# EAGLE schematic voltage_regulator (EAGLE 8.6.3)
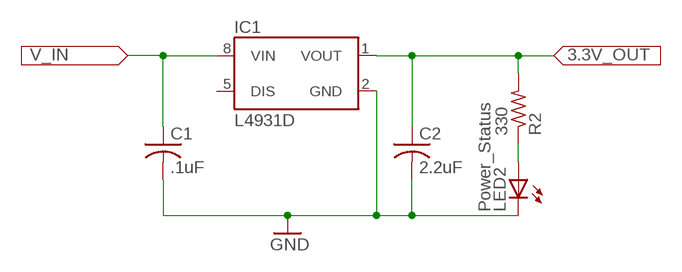
[diagram p0: schematic, sheet 1]

## Parts
C1  .1uF  C-US050-024X044  [C050-024X044]
C2  2.2uF  C-US050-024X044  [C050-024X044]
IC1  L4931D  [SO08]
LED2  Power_Status  NFSG036BT  [NFSG036BT]
R2  330  R-US_R0805  [R0805]

## Nets
3.3V: C2.1 IC1.1(VOUT) R2.2
GND: C1.2 C2.2 IC1.2(GND) LED2.C
N$1: LED2.A R2.1
N$5: C1.1 IC1.8(VIN)
Unconnected: IC1.5(DIS)

## Library data of the parts
C1 C2 = rcl:C-US: CAPACITOR, American symbol; SPICEPREFIX: C
IC1 = v-reg-3:L4931: STMicroelectronics <http://www.st.com> 250mA low dropout voltage regulator Vin 5V to 28V (transients 40V), disable pin, 50µA shutdown current
LED2 = led:NFSG036BT: CHIP TYPE GREEN LED NFSx036xT Source: NICHIA CORPORATION .. NFSG036BT-E.pdf
R2 = rcl:R-US_: RESISTOR, American symbol; SPICEPREFIX: R